# EAGLE design thermo_single (EAGLE 7.7.0)
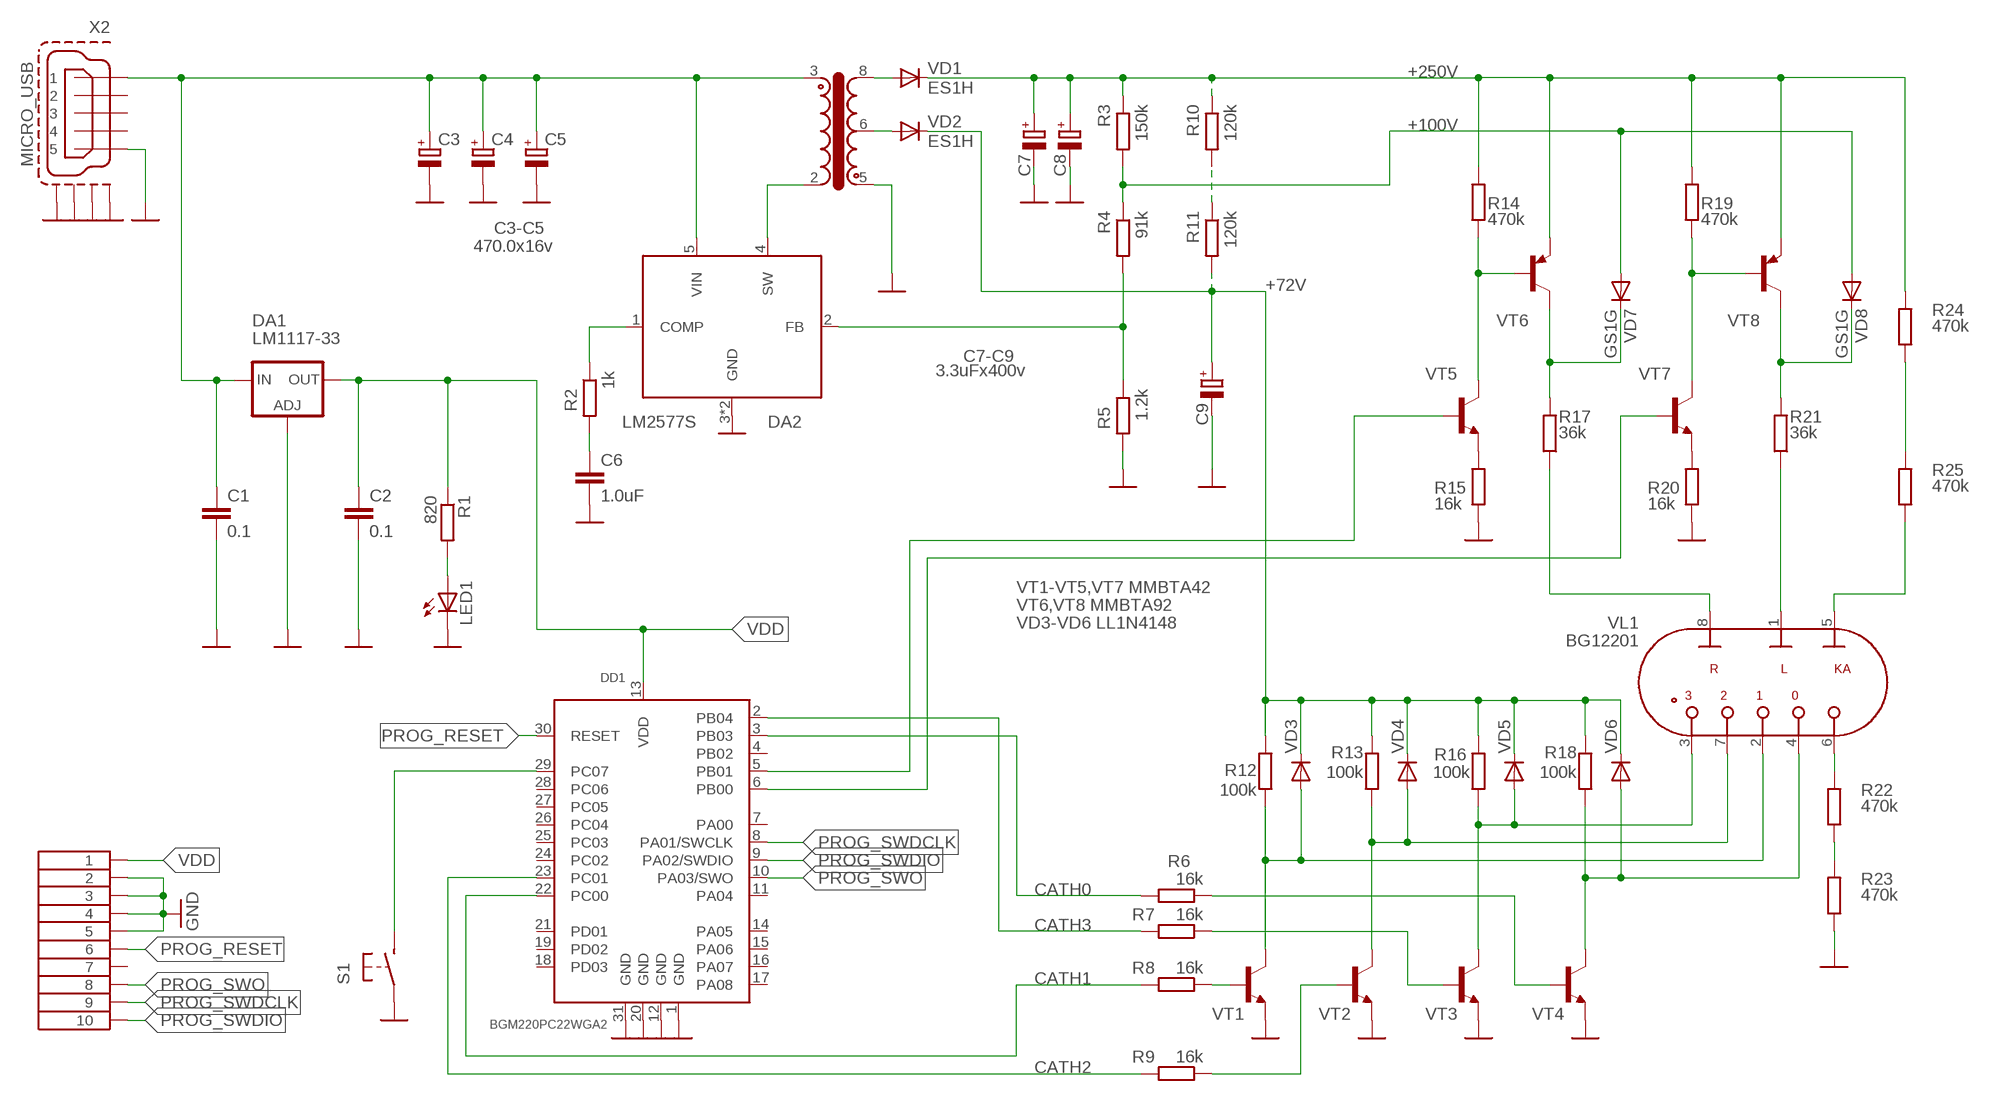
[diagram p0: schematic, sheet 1]

## Parts
C1  0.1  C-EUC0805  [C0805]
C2  0.1  C-EUC0805  [C0805]
C3  470.0x16v  CPOL-EUG  [PANASONIC_G]
C4  470.0x16v  CPOL-EUG  [PANASONIC_G]
C5  470.0x16v  CPOL-EUG  [PANASONIC_G]
C6  1.0uF  C-EUC1206  [C1206]
C7  3.3uFx400v  CPOL-EUG  [PANASONIC_G]
C8  3.3uFx400v  CPOL-EUG  [PANASONIC_G]
C9  3.3uFx400v  CPOL-EUG  [PANASONIC_G]
DA1  LM1117-33  LD117AS33TR  [SOT223]
DA2  LM2577S  [TO263-5]
DD1  BGM220PC22WGA2  [BGM13P22F512GEV2]
LED1  LEDP-LCC-2  [P-LCC-2]
R1  820  R-EU_R0805  [R0805]
R2  1k  R-EU_R0805  [R0805]
R3  150k  R-EU_R0805  [R0805]
R4  91k  R-EU_R0805  [R0805]
R5  1.2k  R-EU_R0805  [R0805]
R6  16k  R-EU_R0805  [R0805]
R7  16k  R-EU_R0805  [R0805]
R8  16k  R-EU_R0805  [R0805]
R9  16k  R-EU_R0805  [R0805]
R10  120k  R-EU_R0805  [R0805]
R11  120k  R-EU_R0805  [R0805]
R12  100k  R-EU_R0805  [R0805]
R13  100k  R-EU_R0805  [R0805]
R14  470k  R-EU_R0805  [R0805]
R15  16k  R-EU_R0805  [R0805]
R16  100k  R-EU_R0805  [R0805]
R17  36k  R-EU_R0805  [R0805]
R18  100k  R-EU_R0805  [R0805]
R19  470k  R-EU_R0805  [R0805]
R20  16k  R-EU_R0805  [R0805]
R21  36k  R-EU_R0805  [R0805]
R22  470k  R-EU_R0805  [R0805]
R23  470k  R-EU_R0805  [R0805]
R24  470k  R-EU_R0805  [R0805]
R25  470k  R-EU_R0805  [R0805]
S1  10-XXPTS636SJ25  [PTS636SJ25]
T1  TRANSFFB  [EFD20-8]
VD1  ES1H  DIODE-DO-214AC  [DO-214AC]
VD2  ES1H  DIODE-DO-214AC  [DO-214AC]
VD3  LL4148  DIODE-SOD80C  [SOD80C]
VD4  LL4148  DIODE-SOD80C  [SOD80C]
VD5  LL4148  DIODE-SOD80C  [SOD80C]
VD6  LL4148  DIODE-SOD80C  [SOD80C]
VD7  GS1G  DIODE-DO-214AC  [DO-214AC]
VD8  GS1G  DIODE-DO-214AC  [DO-214AC]
VL1  BG12201  [BG12201]
VT1  mmbta42  MMBTA42LT1-NPN-SOT23-BEC  [SOT23-BEC]
VT2  mmbta42  MMBTA42LT1-NPN-SOT23-BEC  [SOT23-BEC]
VT3  mmbta42  MMBTA42LT1-NPN-SOT23-BEC  [SOT23-BEC]
VT4  mmbta42  MMBTA42LT1-NPN-SOT23-BEC  [SOT23-BEC]
VT5  mmbta42  MMBTA42LT1-NPN-SOT23-BEC  [SOT23-BEC]
VT6  mmbta92  MMBTA92LT1-PNP-SOT23-BEC  [SOT23-BEC]
VT7  mmbta42  MMBTA42LT1-NPN-SOT23-BEC  [SOT23-BEC]
VT8  mmbta92  MMBTA92LT1-PNP-SOT23-BEC  [SOT23-BEC]
X1  PINHEAD2X5  [DS1031-08-2*5P8BS-4-1]
X2  MICRO_USB  [MICRO_USB_MOLEX]

## Nets
+5V: C1.1 C3.+ C4.+ C5.+ DA1.3(IN) DA2.5(VIN) T1.3 X2.1
+72V: C9.+ R11.2 R12.2 R13.2 R16.2 R18.2 VD2.1(C) VD3.C VD4.C VD5.C VD6.C
+100V: R3.2 R4.1 VD7.2(A) VD8.2(A)
+250V: C7.+ C8.+ R3.1 R10.1 R14.2 R19.2 R24.2 VD1.1(C) VT6.E VT8.E
ANODE0: DD1.5(PB01) VT5.B
ANODE1: DD1.6(PB00) VT7.B
CATH0: DD1.3(PB03) R6.2
CATH1: DD1.22(PC00) R8.2
CATH2: DD1.23(PC01) R9.2
CATH3: DD1.2(PB04) R7.2
CH1ANODE: R21.1 VL1.1(LA)
CH2ANODE: R17.1 VL1.8(RA)
GND: C1.2 C2.2 C3.- C4.- C5.- C6.2 C7.- C8.- C9.- DA1.1(ADJ) DA2.3(GND) DA2.6(GND) DD1.1(GND) DD1.12(GND) DD1.20(GND) DD1.31(GND) LED1.C R5.2 R15.1 R20.1 R23.1 S1.P$1(P) T1.5 VT1.E VT2.E VT3.E VT4.E X1.2 X1.3 X1.4 X1.5 X2.5 X2.P$1(S1) X2.P$2(S2) X2.P$4(S3) X2.P$5(S4)
KA_ANODE: R25.1 VL1.5(KA_A)
KEY: DD1.29(PC07) S1.P$2(S)
N$1: DA2.4(SW) T1.2
N$2: R22.2 VL1.6(KA_C)
N$3: R22.1 R23.2
N$4: DA2.2(FB) R4.2 R5.1
N$5: C6.1 R2.2
N$6: DA2.1(COMP) R2.1
N$7: R15.2 VT5.E
N$8: R20.2 VT7.E
N$9: R14.1 VT5.C VT6.B
N$10: R10.2 R11.1
N$11: R19.1 VT7.C VT8.B
N$17: R8.1 VT1.B
N$18: R7.1 VT3.B
N$19: R6.1 VT4.B
N$20: R9.1 VT2.B
N$21: R17.2 VD7.1(C) VT6.C
N$22: R21.2 VD8.1(C) VT8.C
N$24: T1.6 VD2.2(A)
N$26: T1.8 VD1.2(A)
N$33: R24.1 R25.2
N$56: LED1.A R1.2
PH1CATHODE: R12.1 VD3.A VL1.2(C1) VT1.C
PH2CATHODE: R13.1 VD4.A VL1.7(C2) VT2.C
PH3CATHODE: R16.1 VD5.A VL1.3(C3) VT3.C
PROG_RESET: DD1.30(RESET) X1.6
PROG_SWDCLK: DD1.8(PA01/SWCLK) X1.9
PROG_SWDIO: DD1.9(PA02/SWDIO) X1.10
PROG_SWO: DD1.10(PA03/SWO) X1.8
RESETCATHODE: R18.1 VD6.A VL1.4(CR) VT4.C
VDD: C2.1 DA1.4(OUT) DD1.13(VDD) R1.1 X1.1
Unconnected: DD1.4(PB02) DD1.7(PA00) DD1.11(PA04) DD1.14(PA05) DD1.15(PA06) DD1.16(PA07) DD1.17(PA08) DD1.18(PD03) DD1.19(PD02) DD1.21(PD01) DD1.24(PC02) DD1.25(PC03) DD1.26(PC04) DD1.27(PC05) DD1.28(PC06) X1.7 X2.2 X2.3 X2.4

## Notes on the sheet
- C3-C5
- C7-C9
- VT1-VT5,VT7 MMBTA42
- VT6,VT8 MMBTA92
- VD3-VD6 LL1N4148

## Library data of the parts
C1 C2 C6 = rcl:C-EU: CAPACITOR, European symbol
C3-C5 C7-C9 = rcl:CPOL-EU: POLARIZED CAPACITOR, European symbol
DA1 = v-reg:LD117A?*: Low drop fixed and adjustable positive voltage regulators 1 A Source: http://www.st.com/stonline/products/literature/ds/7194/ld1117axx.pdf
DA2 = nixie_pic:LM2577
DD1 = BGX13P22GA-V21R:BGM220PC22WGA2
LED1 = led:LED: LED OSRAM: - CHIPLED LG R971, LG N971, LY N971, LG Q971, LY Q971, LO R971, LY R971 LH N974, LH R974 LS Q976, LO Q976, LY Q976 LO Q996 - Hyper CHIPLED LW Q18S LB Q993, LB Q99A, LB R99A - SideLED LS A670, LO A670, LY A670, LG A670, LP A670 LB A673, LV A673, LT A673, LW A673 LH A674 LY A675 LS A676, LA A676, LO A676, LY A676, LW A676 LS A679, LY A679, LG A679 - Hyper Micro SIDELED® LS Y876, LA Y876, LO Y876, LY Y876 LT Y87S - SmartLED LW L88C, LW L88S LB L89C, LB L89S, LG L890 LS L89K, LO L89K, LY L89K LS L896, LA L896, LO L896, LY L896 - TOPLED LS T670, LO T670, LY T670, LG T670, LP T670 LSG T670, LSP T670, LSY T670, LOP T670, LYG T670 LG T671, LOG T671, LSG T671 LB T673, LV T673, LT T673, LW T673 LH T674 LS T676, LA T676, LO T676, LY T676, LB T676, LH T676, LSB T676, LW T676 LB T67C, LV T67C, LT T67C, LS T67K, LO T67K, LY T67K, LW E67C LS E67B, LA E67B, LO E67B, LY E67B, LB E67C, LV E67C, LT E67C LW T67C LS T679, LY T679, LG T679 LS T770, LO T770, LY T770, LG T770, LP T770 LB T773, LV T773, LT T773, LW T773 LH T774 LS E675, LA E675, LY E675, LS T675 LS T776, LA T776, LO T776, LY T776, LB T776 LHGB T686 LT T68C, LB T68C - Hyper Mini TOPLED® LB M676 - Mini TOPLED Santana® LG M470 LS M47K, LO M47K, LY M47K Source: http://www.osram.convergy.de LUXEON: - LUMILED® LXK2-PW12-R00, LXK2-PW12-S00, LXK2-PW14-U00, LXK2-PW14-V00 LXK2-PM12-R00, LXK2-PM12-S00, LXK2-PM14-U00 LXK2-PE12-Q00, LXK2-PE12-R00, LXK2-PE12-S00, LXK2-PE14-T00, LXK2-PE14-U00 LXK2-PB12-K00, LXK2-PB12-L00, LXK2-PB12-M00, LXK2-PB14-N00, LXK2-PB14-P00, LXK2-PB14-Q00 LXK2-PR12-L00, LXK2-PR12-M00, LXK2-PR14-Q00, LXK2-PR14-R00 LXK2-PD12-Q00, LXK2-PD12-R00, LXK2-PD12-S00 LXK2-PH12-R00, LXK2-PH12-S00 LXK2-PL12-P00, LXK2-PL12-Q00, LXK2-PL12-R00 Source: www.luxeon.com KINGBRIGHT: KA-3528ASYC Source: www.kingbright.com
R1-R25 = rcl:R-EU_: RESISTOR, European symbol
S1 = pololu:10-XX: OMRON SWITCH
T1 = stm8clock:TRANSFFB
VD1 VD2 VD7 VD8 = dp_devices:DIODE: Various Diode Packages
VD3-VD6 = diode:DIODE-: DIODE
VL1 = nixie_term:BG12201
VT1-VT5 VT7 = transistor-neu-to92:*-NPN-: NPN Transistror
VT6 VT8 = transistor-neu-to92:*-PNP-: PNP Transistror
X1 = pololu:PINHEAD2X5
X2 = pololu:MICRO_USB

## Board
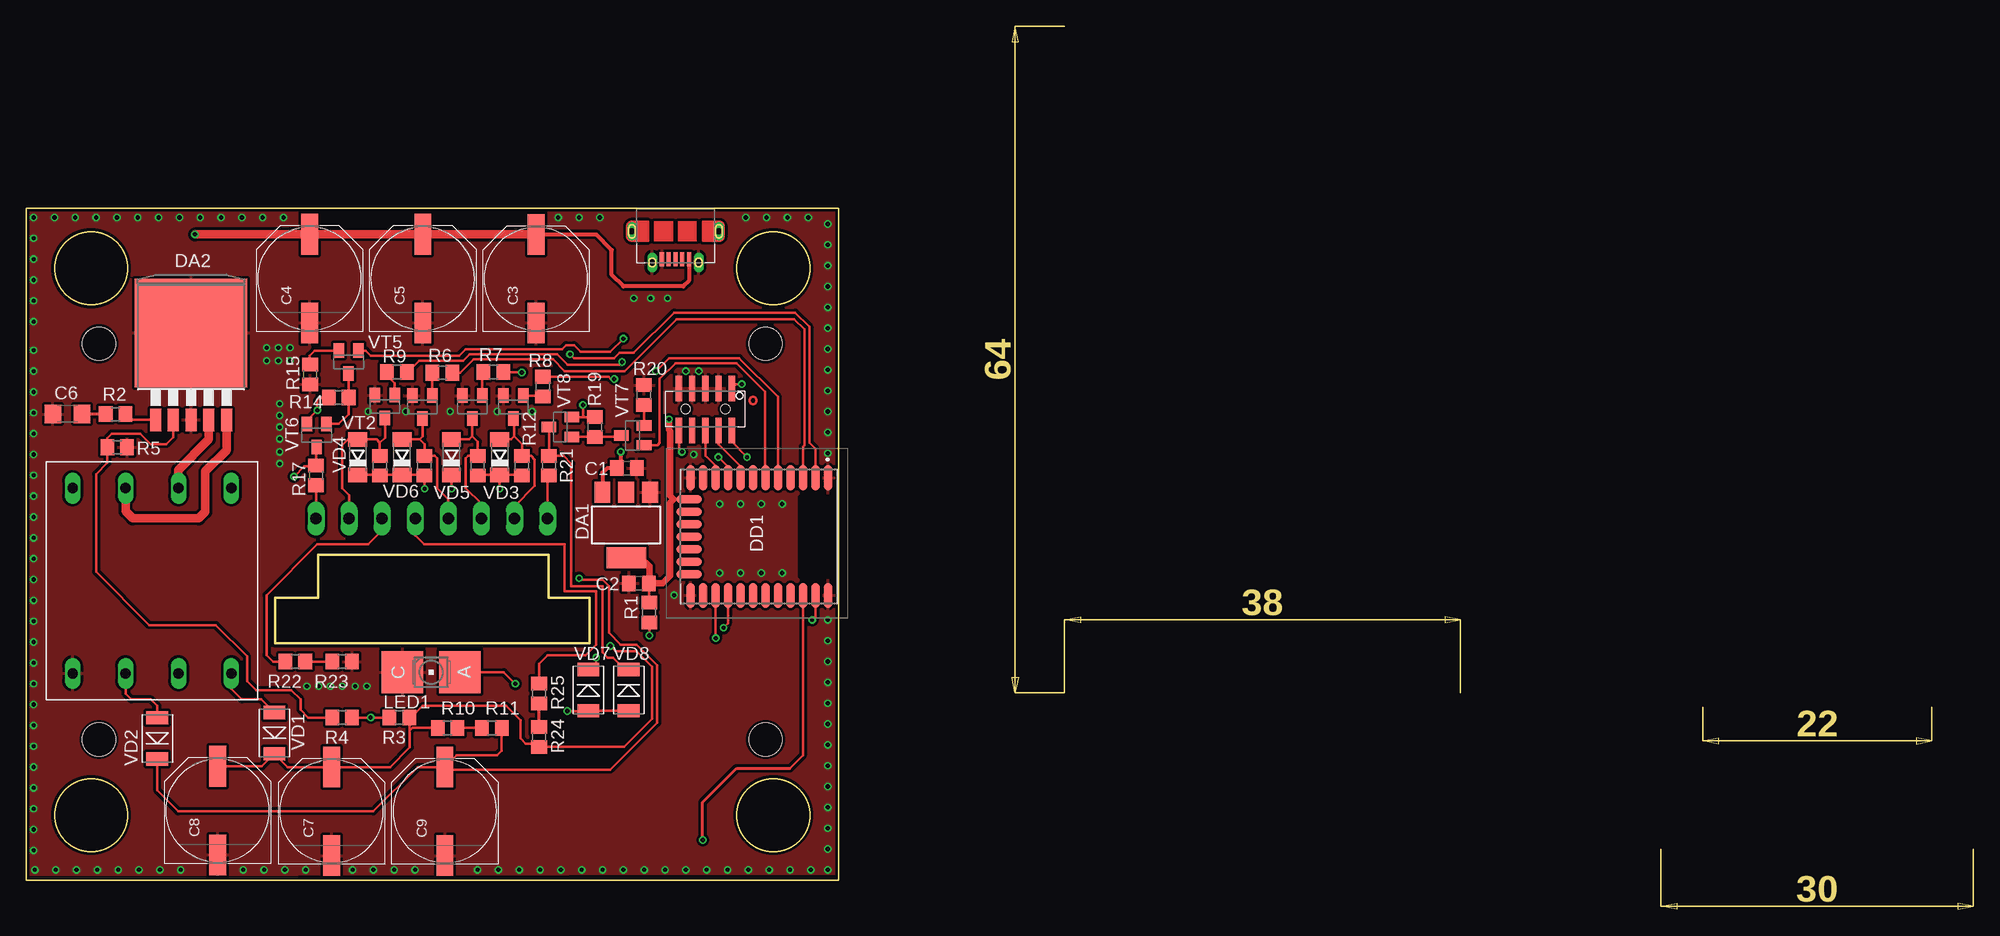
[diagram p1: board, top side]
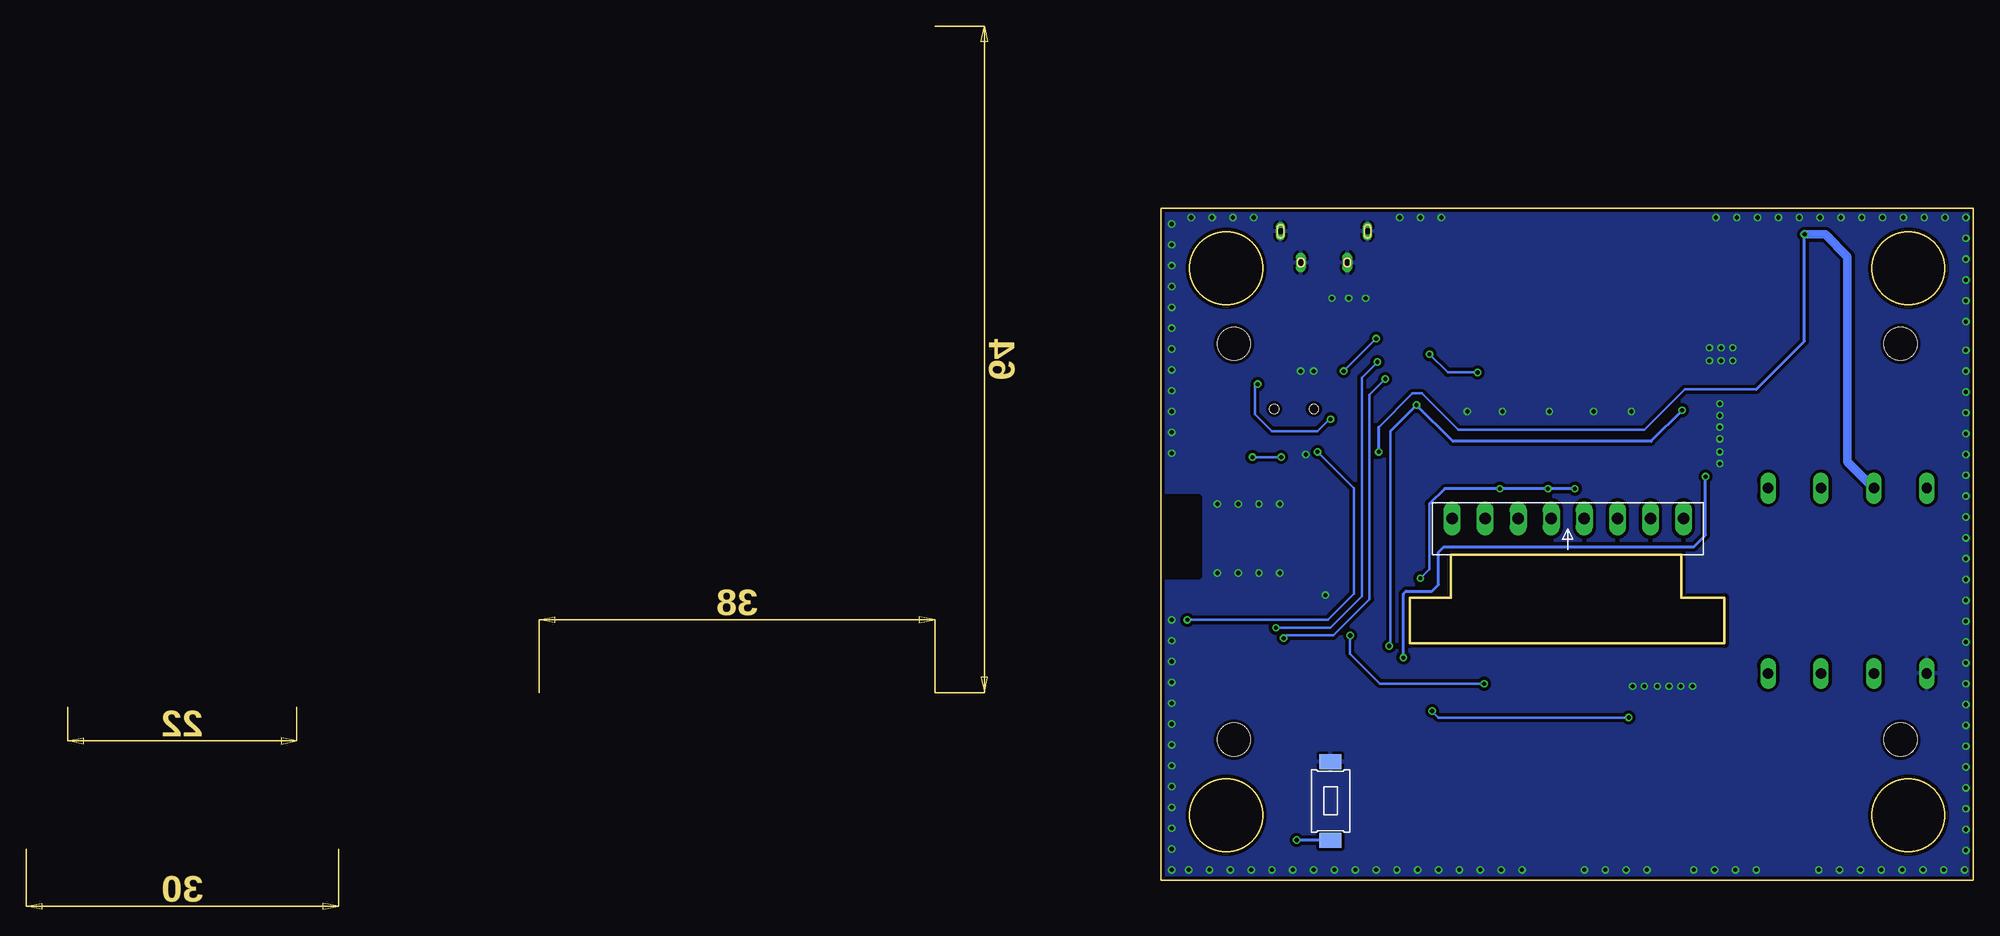
[diagram p2: board, bottom side, seen from below]

Size 186.97 x 84.8 mm. Coordinates in mm from the lower left corner, seen from the top.
Outline: 28.05,29.93 28.05,34.03 50.15,34.03 50.15,29.93 54.1,29.93 54.1,25.55 23.9,25.55 23.9,29.93 28.05,29.93
Copper layers (1*16): Top 0.035mm / dielectric 1.5mm / Bottom 0.035mm
Design rules "jlc": minimum track width 5mil, minimum drill 0.2mm, track to track 5mil, track to pad 0.2mm, pad to pad 5mil, via to via 10mil, smd to smd 0mil, copper to edge 10mil, drill to drill 10mil, minimum pad ring 0.13mm, minimum via ring 6mil, stop-mask expansion 0.05mm, vias tented up to drill 100mil, thermal gap 10mil
Holes 3.2 mm at 7,54.3 7,16.3 71,16.3 71,54.3

### Footprints (pad centres in the part's own frame; a part is rotated, then mirrored left to right if it is on the bottom)
C0805 = smd 1.3 x 1.5: 1 -0.95,0; 2 0.95,0
PANASONIC_G = smd 3.9 x 1.6: + 4.25,0; - -4.25,0
C1206 = smd 1.6 x 1.8: 1 -1.4,0; 2 1.4,0
SOT223 = smd 1.5 x 2: 1 -2.3,-3.15; 2 0,-3.15; 3 2.3,-3.15 | smd 3.8 x 2: 4 0,3.15
TO263-5 = smd 1.067 x 2.159: 1 -3.404,-5.791; 2 -1.702,-5.791; 3 0,-5.791; 4 1.702,-5.791; 5 3.404,-5.791 | smd 10.8 x 10.41: 6 0,2.54
BGM13P22F512GEV2 = smd 2.4 x 0.8: 1 -5.65,6.65; 2 -5.65,5.45; 3 -5.65,4.25; 4 -5.65,3.05; 5 -5.65,1.85; 6 -5.65,0.65; 7 -5.65,-0.55; 8 -5.65,-1.75; 9 -5.65,-2.95; 10 -5.65,-4.15; 11 -5.65,-5.35; 12 -5.65,-6.55; 20 5.65,-6.55; 21 5.65,-5.35; 22 5.65,-4.15; 23 5.65,-2.95; 24 5.65,-1.75; 25 5.65,-0.55; 26 5.65,0.65; 27 5.65,1.85; 28 5.65,3.05; 29 5.65,4.25; 30 5.65,5.45; 31 5.65,6.65 | smd 0.8 x 2.4: 13 -3.6,-6.69; 14 -2.4,-6.69; 15 -1.2,-6.69; 16 0,-6.69; 17 1.2,-6.69; 18 2.4,-6.69; 19 3.6,-6.69
P-LCC-2 = smd 4 x 4: A 0,2.75; C 0,-2.75
R0805 = smd 1.3 x 1.5: 1 -0.95,0; 2 0.95,0
PTS636SJ25 = smd 1.45 x 2.1: P$1 -3.775,0; P$2 3.775,0
EFD20-8 = drill 1 long: 1 -8.89,7.62; 2 -8.89,2.54; 3 -8.89,-2.54; 4 -8.89,-7.62; 5 8.89,-7.62; 6 8.89,-2.54; 7 8.89,2.54; 8 8.89,7.62
DO-214AC = smd 1.27 x 2.1: 1 -1.98,0; 2 1.98,0
SOD80C = smd 1.4 x 1.8: A 1.7,0; C -1.7,0
BG12201 = drill 1.1 long: 1 11.113,0; 2 7.938,0; 3 4.763,0; 4 1.587,0; 5 -1.587,0; 6 -4.763,0; 7 -7.938,0; 8 -11.113,0
SOT23-BEC = smd 1 x 1.4: B -0.95,-1.1; C 0,1.1; E 0.95,-1.1
DS1031-08-2*5P8BS-4-1 = smd 0.6 x 2.45: 1 -2.54,-1.98; 2 -1.27,-1.98; 3 0,-1.98; 4 1.27,-1.98; 5 2.54,-1.98; 6 2.54,2.07; 7 1.27,2.07; 8 0,2.07; 9 -1.27,2.07; 10 -2.54,2.07 | hole 0.9: -1.905,0; 1.905,0
MICRO_USB_MOLEX = smd 0.4 x 1.35: 1 -1.3,4.125; 2 -0.65,4.125; 3 0,4.125; 4 0.65,4.125; 5 1.3,4.125 | drill 0.65 pad 0.8 long: P$1 -2.225,4.45; P$2 2.225,4.45 | drill 0.6 pad 0.85 long: P$4 -4.175,1.45; P$5 4.175,1.45

### Placement (x,y rotation side)
C1  57.69,42.37 0 top
C2  58.84,31.3 180 top
C3  48.98,60.55 90 top
C4  27.23,60.56 90 top
C5  38.1,60.56 90 top
C6  3.98,47.55 180 top
C7  29.35,9.43 90 top
C8  18.4,9.5 90 top
C9  40.23,9.43 90 top
DA1  57.62,36.9 180 top
DA2  15.85,52.8 0 top
DD1  70.35,35.79 270 top
LED1  38.9,22.78 270 top
R1  59.83,28.51 270 top
R2  8.6,47.55 180 top
R3  35.85,18.43 180 top
R4  30.35,18.43 180 top
R5  8.75,44.37 0 top
R6  39.98,51.52 0 top
R7  44.86,51.59 0 top
R8  49.62,50.18 90 top
R9  35.61,51.58 0 top
R10  40.48,17.43 0 top
R11  44.73,17.43 0 top
R12  47.61,42.59 270 top
R13  33.98,42.59 270 top
R14  30.03,49.14 180 top
R15  27.28,51.35 90 top
R16  43.37,42.59 270 top
R17  27.85,41.67 90 top
R18  38.25,42.59 270 top
R19  54.62,46.32 90 top
R20  59.32,49.38 270 top
R21  50.22,42.6 90 top
R22  25.85,23.8 180 top
R23  30.35,23.8 180 top
R24  49.27,16.55 270 top
R25  49.27,20.72 270 top
S1  61.73,10.43 270 bottom
T1  12.1,31.55 270 top
U$1  [50-200-11]  39,35.3 0 top
U$5  [50-200-11]  39,35.3 0 top
VD1  23.85,16.93 90 top
VD2  12.6,16.43 90 top
VD3  45.48,43.42 90 top
VD4  31.85,43.42 90 top
VD5  40.85,43.42 90 top
VD6  36.1,43.42 90 top
VD7  53.98,21.05 270 top
VD8  57.86,21.05 270 top
VL1  38.95,37.53 180 bottom
VT1  46.79,48.23 180 top
VT2  34.46,48.27 180 top
VT3  42.86,48.23 180 top
VT4  38.05,48.23 180 top
VT5  30.97,52.55 180 top
VT6  27.91,45.51 180 top
VT7  58.24,45.51 90 top
VT8  51.3,46.31 90 top
X1  65.22,48.04 180 top
X2  62.35,66.55 180 top

### Tracks (layer width: path | path; a pad name or v marks a point on that pad's centre or on a via)
+5V  (via drill 0.4)
  Top 0.254: 16.23,64.81 v16.23,64.8
  Top 0.406: X2.1 63.65,60.35 63.1,59.8 57.35,59.8 56.23,60.92 56.23,63.3 54.73,64.8 C3.+ | v57.1,43.92 57.1,42.73 C1.1 55.8,42.37 55.35,41.92 55.35,40.09 DA1.3
  Top 0.813: 16.23,64.81 C4.+ C5.+ C3.+ | T1.3 9.56,38.21 10.23,37.55 16.6,37.55 17.23,38.17 17.23,42.05 19.25,44.08 DA2.5
  Bottom 0.254: 57.1,46.3 53.85,49.55 52.98,49.55 49.48,46.05 31.6,46.05 27.73,49.92 20.85,49.92
  Bottom 0.305: v57.1,43.92 57.1,46.3 | 20.85,49.92 16.23,54.55 v16.23,64.8
  Bottom 0.813: v16.23,64.8 14.23,64.8 12.1,62.67 12.1,42.98 T1.3
+72V  (via drill 0.4)
  Top 0.254: C9.+ 37.6,13.68 33.35,9.43 14.6,9.43 12.6,11.43 VD2.1 | v45.48,40.39 VD3.C | VD3.C 47.52,41.72 R12.2 | VD3.C 43.45,41.72 R16.2 | v40.85,40.39 VD5.C | VD4.C 33.89,41.72 R13.2 34.06,41.72 VD6.C 38.16,41.72 R18.2 38.27,41.62 v38.27,40.39 | R11.2 45.68,15.25 45.23,14.8 41.35,14.8 C9.+ | v53.1,31.8 53.23,31.68 55.35,31.68 55.98,31.05 55.98,26.55 57.1,25.43 58.6,25.43 60.6,23.43 60.6,17.93 56.1,13.43 40.48,13.43 C9.+
  Bottom 0.254: 52.23,38.92 52.23,32.67 v53.1,31.8
  Bottom 0.305: v38.27,40.39 v40.85,40.39 v45.48,40.39 50.76,40.39 52.23,38.92
+100V  (via drill 0.4)
  Top 0.254: VD8.2 VD7.2 53.97,19.05 v51.98,19.05 | R3.2 v33.1,18.43 R4.1
  Bottom 0.254: v33.1,18.43 51.35,18.43 v51.98,19.05
+250V  (via drill 0.4)
  Top 0.254: VT8.E 53.6,47.26 | 53.6,47.26 54.61,47.26 R19.2 | v53.48,48.42 53.48,47.38 53.6,47.26 | R14.2 28.19,49.14 27.98,48.92 v27.98,47.92 26.96,46.9 VT6.E | 36.85,17.18 36.85,15.55 34.98,13.68 C7.+ 25.13,13.68 VD1.1 22.64,13.75 C8.+ | 36.85,17.18 36.85,18.38 | 36.85,18.38 R3.1 | 36.85,18.38 36.93,18.38 38.1,19.55 46.1,19.55 47.48,18.18 47.48,16.43 47.98,15.93 48.94,15.93 R24.2 57.4,15.6 60.1,18.3 60.1,23.3 58.6,24.8 56.6,24.8 v56.1,25.3 | R10.1 37.1,17.43 36.85,17.18
  Bottom 0.254: 55.98,45.92 55.98,25.43 v56.1,25.3
  Bottom 0.305: 55.98,45.92 55.12,46.78 55.12,46.77 v53.48,48.41 v53.48,48.42 49.98,44.92 30.98,44.92 v27.98,47.92
ANODE0  (via drill 0.4)
  Top 0.254: v60.48,51.67 61.73,52.92 68.47,52.92 72.2,49.2 DD1.5 | VT5.B 32.63,53.65 33.1,53.17 41.6,53.17 42.23,53.8 51.48,53.8 51.85,54.17 52.6,54.17 53.23,53.55 56.1,53.55 v57.35,54.8
  Bottom 0.254: v60.48,51.67 v57.35,54.8
ANODE1
  Top 0.254: VT7.B 60.61,44.56 60.85,44.8 60.85,50.92 62.35,52.42 68.22,52.42 70.97,49.67 70.97,41.46 DD1.6
CATH0
  Top 0.254: DD1.3 74.6,44.42 74.72,44.55 74.72,55.67 73.72,56.67 62.48,56.67 57.48,51.67 51.73,51.67 50.6,52.8 42.98,52.8 41.7,51.52 R6.2
CATH1  (via drill 0.4)
  Top 0.254: R8.2 55.94,51.13 56.15,50.92 v56.48,50.92 | v66.22,26.05 66.2,26.07 DD1.22
  Bottom 0.254: v66.22,26.05 65.97,26.3 61.48,26.3 57.98,29.8 57.98,49.42 v56.48,50.92
CATH2  (via drill 0.4)
  Top 0.254: R9.2 36.63,51.58 37.73,52.67 41.98,52.67 42.6,53.3 50.98,53.3 51.98,52.3 56.98,52.3 v57.23,52.55 | DD1.23 67.4,27.48 v66.97,27.05
  Bottom 0.254: v66.97,27.05 61.73,27.05 58.73,30.05 58.73,51.05 v57.23,52.55
CATH3  (via drill 0.4)
  Top 0.254: R7.2 47.56,51.59 v47.6,51.55 | v52.23,53.3 52.6,52.92 56.48,52.92 56.98,53.42 58.35,53.42 62.23,57.3 73.85,57.3 75.22,55.92 75.22,44.8 75.8,44.22 DD1.2
  Bottom 0.254: v47.6,51.55 50.48,51.55 v52.23,53.3
CH1ANODE
  Top 0.254: VL1.1 50.06,41.49 R21.1
CH2ANODE
  Top 0.254: R17.1 VL1.8
GND  (via drill 0.4)
  other vias: 66.6,32.3 68.6,32.3 70.6,32.3 72.6,32.3 66.6,38.92 68.6,38.92 70.6,38.92 72.6,38.92 76.97,55.8 76.97,53.8 76.97,51.8 76.97,49.8 76.97,47.8 76.97,45.8 76.97,43.8 32.85,47.8 36.48,47.8 40.73,47.8 45.23,47.8 76.97,3.8 76.97,5.8 76.97,7.8 76.97,9.8 76.97,11.8 76.97,13.8 76.97,15.8 76.97,17.8 76.97,19.8 76.97,21.8 76.97,23.8 76.97,25.8 76.97,27.8 62.23,30.18 63.35,51.67 64.6,51.67 58.35,58.67 59.98,58.67 61.6,58.67 76.97,65.8 76.97,63.8 76.97,61.8 76.97,59.8 76.97,57.8 24.35,48.55 24.35,47.42 24.35,46.3 24.35,45.17 24.35,43.92 24.35,42.8 26.98,21.43 28.1,21.43 29.23,21.43 30.35,21.43 31.6,21.43 32.73,21.43 24.85,3.8 22.85,3.8 20.85,3.8 26.85,3.8 14.85,3.8 12.85,3.8 10.85,3.8 8.85,3.8 6.85,3.8 4.85,3.8 2.85,3.8 0.85,3.8 75.35,3.8 73.35,3.8 71.35,3.8 69.35,3.8 67.35,3.8 65.35,3.8 63.35,3.8 61.35,3.8 59.35,3.8 57.35,3.8 55.35,3.8 53.35,3.8 51.35,3.8 0.73,5.67 0.73,7.67 0.73,9.68 0.73,11.68 0.73,13.68 0.73,15.68 0.73,17.68 0.73,19.68 0.73,21.68 0.73,23.68 0.73,25.68 0.73,27.68 0.73,29.68 0.73,31.68 0.73,33.67 0.73,35.67 0.73,37.67 0.73,39.67 0.73,41.67 0.73,43.67 0.73,45.67 0.73,47.67 0.73,49.67 0.73,51.67 0.73,53.67 0.73,64.42 0.73,62.42 0.73,60.42 0.73,58.42 0.73,56.42 0.73,66.42 2.73,66.42 4.73,66.42 6.73,66.42 8.73,66.42 10.73,66.42 12.73,66.42 14.73,66.42 16.73,66.42 18.73,66.42 20.73,66.42 22.73,66.42 24.73,66.42 75.1,66.42 73.1,66.42 71.1,66.42 69.1,66.42 55.1,66.42 53.1,66.42 51.1,66.42 23.1,52.67 24.23,52.67 25.35,52.67 25.35,53.92 24.23,53.92 23.1,53.92 64.1,43.67 49.35,3.8 47.35,3.8 45.35,3.8 43.35,3.8 37.35,3.8 35.35,3.8 33.35,3.8 31.35,3.8 48.6,47.8
  pour Bottom (isolate 0.305): -0.05,67.05 77.74,67.05 77.74,49.27 78.05,24.82 78.05,2.92 -0.05,2.92
  pour Top (isolate 0.254): 0.1,3.31 0.1,67.19 41.48,67.06 41.98,67.19 42.6,67.17 58.6,67.19 77.97,67.19 77.97,46.68 78.1,3.43
KA_ANODE
  Top 0.254: VL1.5 37.36,35.91 38.23,35.05 51.73,35.05 51.73,30.55 54.73,30.55 54.73,25.43 53.73,24.43 50.1,24.43 49.27,23.59 R25.1
KEY  (via drill 0.4)
  Top 0.254: DD1.29 74.6,14.8 73.35,13.55
  Top 0.305: 73.35,13.55 68.22,13.55 64.97,10.3 v64.97,6.67
  Bottom 0.305: S1.P$2 64.95,6.65 v64.97,6.67
N$1
  Top 0.813: DA2.4 17.55,45.13 14.6,42.17 14.6,40.48 T1.2
N$2
  Top 0.254: VL1.6 34.19,36.39 32.85,35.05 27.98,35.05 23.1,30.18 23.1,24.43 23.73,23.8 R22.2
N$3
  Top 0.254: R22.1 R23.2
N$4
  Top 0.254: R4.2 27.1,18.43 26.35,19.18 26.35,20.18 25.48,21.05 22.1,21.05 21.23,21.93 21.23,24.3 18.23,27.3 11.85,27.3 6.73,32.42 6.73,41.8 7.8,42.88 R5.1 7.8,45.25 8.23,45.67 10.98,45.67 11.98,44.67 13.48,44.67 14.15,45.35 DA2.2
N$5
  Top 0.305: R2.2 C6.1
N$6
  Top 0.254: DA2.1 10.09,47.01 R2.1
N$7
  Top 0.254: VT5.E 27.7,53.65 27.23,53.17 27.23,52.36 R15.2
N$8
  Top 0.254: VT7.E 59.34,48.41 R20.2
N$9
  Top 0.254: VT5.C R14.1 30.98,47.55 30.04,46.61 VT6.B
N$10
  Top 0.254: R10.2 R11.1
N$11
  Top 0.254: VT8.B 54.61,45.36 R19.1 57,45.37 VT7.C
N$17
  Top 0.254: VT1.B 49.52,49.33 R8.1
N$18
  Top 0.254: VT3.B 43.81,51.49 R7.1
N$19
  Top 0.254: VT4.B 39,51.49 R6.1
N$20
  Top 0.254: VT2.B 35.41,50.49 34.6,51.3 34.6,51.52 R9.1
N$21  (via drill 0.4)
  Top 0.254: v25.73,41.55 26.73,42.55 27.78,42.55 R17.2 27.85,44.35 VT6.C | VD7.1 54.73,23.03 v54.73,24.18
  Bottom 0.305: v54.73,24.18 54.73,30.3 54.48,30.55 51.98,30.55 51.35,31.18 51.35,34.3 50.85,34.8 26.85,34.8 25.73,35.92 v25.73,41.55
N$22
  Top 0.254: VT8.C 50.22,46.3 R21.2 51.6,43.55 52.35,42.8 52.35,31.05 55.35,31.05 55.35,24.68 55.85,24.18 56.35,24.18 57.5,23.03 VD8.1
N$24
  Top 0.254: T1.6 9.56,20.71 10.1,20.18 11.98,20.18 12.6,19.55 VD2.2
N$26
  Top 0.254: VD1.2 22.59,20.18 20.73,20.18 19.72,21.18 T1.8
N$33
  Top 0.305: R24.1 R25.2
N$56  (via drill 0.4)
  Top 0.254: LED1.A 45.87,22.78 v46.98,21.68 | R1.2 59.85,27.56 v59.85,26.3
  Bottom 0.254: v46.98,21.68 56.98,21.68 59.85,24.55 v59.85,26.3
PH1CATHODE
  Top 0.254: 46.86,45.42 46.86,47.06 VT1.C | VL1.2 46.89,38.71 48.85,40.67 48.85,43.17 48.48,43.54 R12.1 47.61,44.67 46.86,45.42 | VD3.A 46.57,45.12 46.86,45.42
PH2CATHODE
  Top 0.254: VT2.C 34.48,47.15 34.48,45.3 33.98,44.8 | 33.98,44.8 R13.1 | 33.98,44.8 33.65,45.12 VD4.A 30.93,45.12 30.35,44.55 30.35,40.42 31.01,39.76 VL1.7
PH3CATHODE
  Top 0.254: VT3.C 42.85,45.42 | VD5.A 42.55,45.12 42.85,45.42 | 42.85,45.42 43.37,44.91 R16.1 42.47,43.54 42.23,43.3 42.23,40.42 43.73,38.92 43.73,37.54 VL1.3
PROG_RESET  (via drill 0.4)
  Top 0.254: DD1.30 75.8,28 75.6,27.8 v75.47,27.8 | 62.85,44.05 v62.98,43.92 62.69,44.21 X1.6
  Bottom 0.254: v75.47,27.8 61.98,27.8 59.48,30.3 59.48,40.42 v62.98,43.92
PROG_SWDCLK
  Top 0.254: DD1.8 68.6,42.55 66.47,44.67 66.47,45.95 X1.9
PROG_SWDIO  (via drill 0.4)
  Top 0.254: DD1.9 67.4,42.5 v66.47,43.42 | v69.22,43.42 67.72,44.92 67.72,45.93 X1.10
  Bottom 0.254: v66.47,43.42 v69.22,43.42
PROG_SWO
  Top 0.254: DD1.10 66.2,42.57 65.22,43.55 X1.8
RESETCATHODE
  Top 0.254: VL1.4 40.54,39.36 39.48,40.42 39.48,43.3 39.23,43.54 R18.1 38.25,44.68 37.8,45.12 | VD6.A 37.8,45.12 | 37.8,45.12 38.1,45.42 38.1,47.08 VT4.C
VDD  (via drill 0.4)
  Top 0.254: DD1.13 62.19,39.39 | v68.72,50.42 68.17,50.42 X1.1 | R1.1 59.83,31.25 C2.1
  Top 0.406: 59.85,31.36 C2.1
  Top 0.61: v61.73,47.05 61.73,46.05 61.85,45.92 61.85,39.73 62.19,39.39 61.85,39.05 61.85,32.05 61.09,31.3 C2.1 | DA1.4 59.02,33.75 59.85,32.92 59.85,31.36
  Bottom 0.254: v61.73,47.05 61.73,47.17 62.98,45.92 67.35,45.92 68.97,47.55 68.97,50.17 v68.72,50.42
(copper drawn outside any net)
  shapes: Top circle x1

### Text on the board
case_top: o | C | 4O | 3O | 2O | 1O | O | -1O | -2O | -3O | -4O